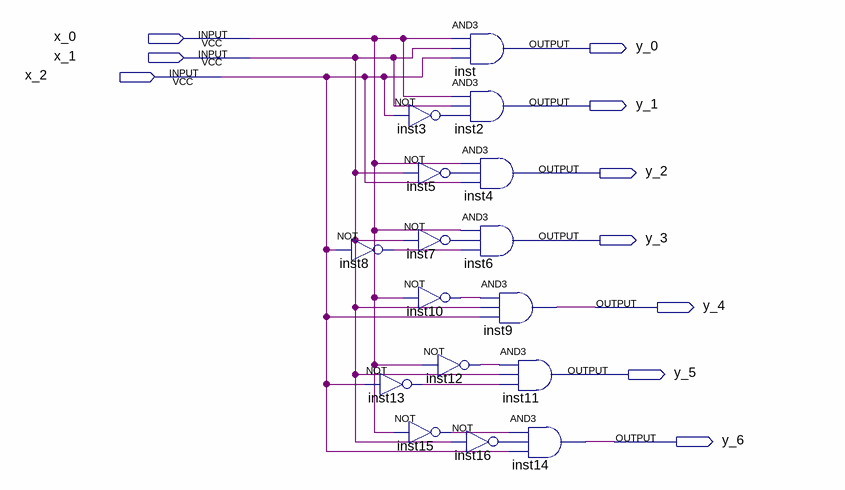
[diagram p0: schematic sheet]
// Quartus schematic which_is_wrong.bdf as structural Verilog: 16 symbols, 10 pins
module which_is_wrong (
  input  x_0,
  input  x_1,
  input  x_2,
  output y_0,
  output y_1,
  output y_2,
  output y_3,
  output y_4,
  output y_5,
  output y_6
);

  wire inst3_out, inst5_out, inst7_out, inst8_out, inst10_out, inst12_out, inst13_out, inst15_out, inst16_out;

  not inst3 (inst3_out, x_2);
  not inst8 (inst8_out, x_2);
  not inst13 (inst13_out, x_2);
  not inst15 (inst15_out, x_0);
  and inst (y_0, x_0, x_1, x_2);
  and inst2 (y_1, x_0, x_1, inst3_out);
  and inst4 (y_2, x_0, inst5_out, x_2);
  not inst5 (inst5_out, x_1);
  and inst6 (y_3, x_0, inst7_out, inst8_out);
  not inst7 (inst7_out, x_1);
  not inst10 (inst10_out, x_0);
  not inst12 (inst12_out, x_0);
  not inst16 (inst16_out, x_1);
  and inst9 (y_4, inst10_out, x_1, x_2);
  and inst11 (y_5, inst12_out, x_1, inst13_out);
  and inst14 (y_6, inst15_out, inst16_out, x_2);
endmodule
